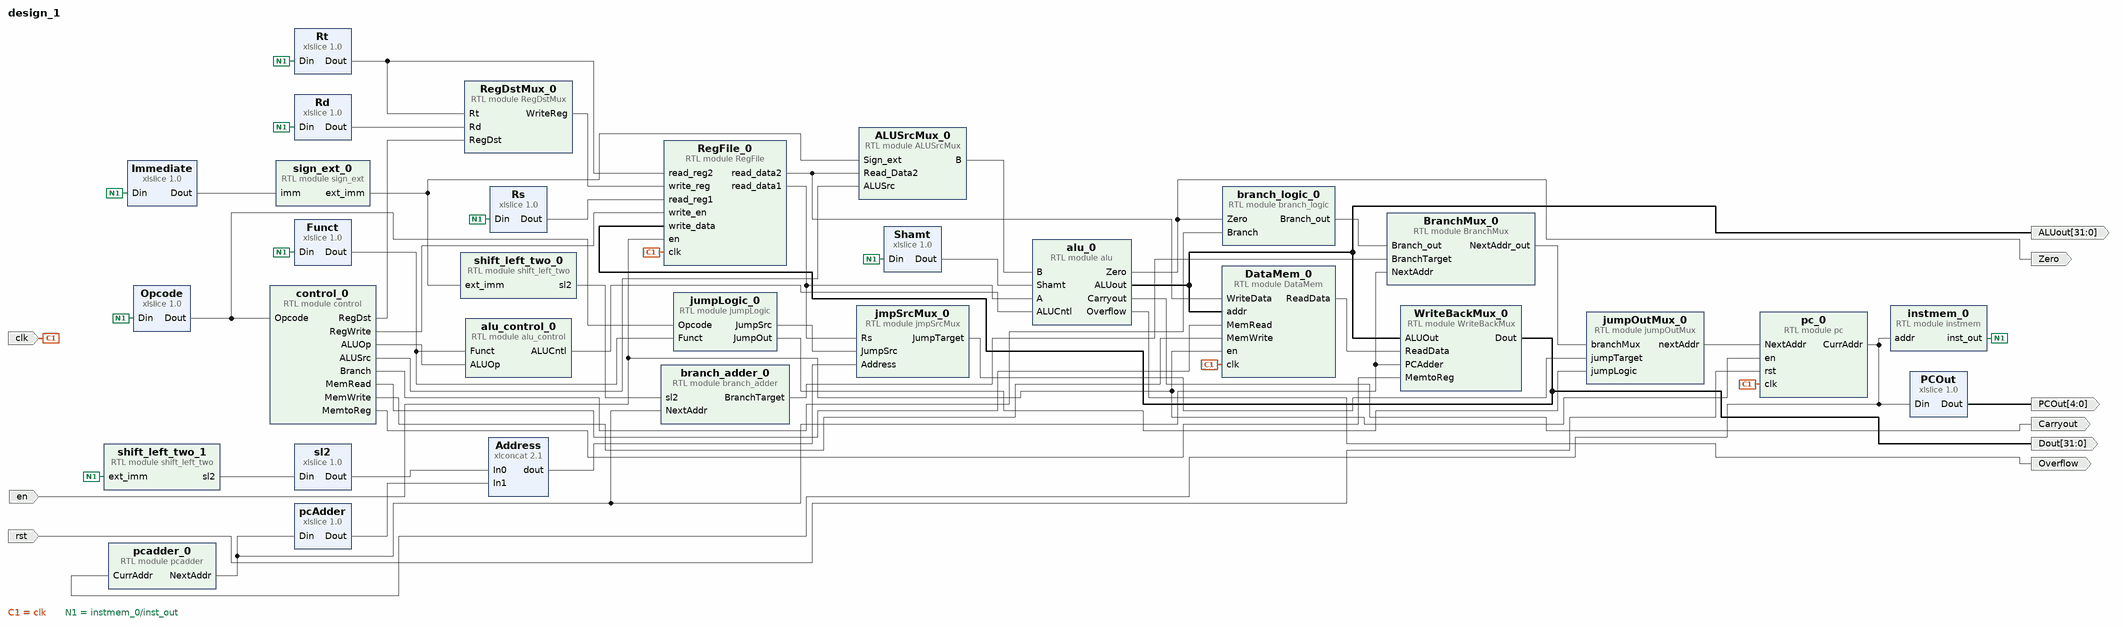
[diagram p0: block diagram of the top level]
# Vivado block design design_1, xc7a35tcpg236-1, Vivado 2023.2
create_bd_design design_1

create_bd_port -dir I -type clk clk
set_property -dict {CONFIG.FREQ_HZ 100000000} [get_bd_ports clk]
create_bd_port -dir I -type rst rst
create_bd_port -dir I -type ce en
create_bd_port -dir O -from 31 -to 0 ALUout
create_bd_port -dir O Carryout
create_bd_port -dir O Overflow
create_bd_port -dir O Zero
create_bd_port -dir O -from 4 -to 0 -type data PCOut
create_bd_port -dir O -from 31 -to 0 -type data Dout

create_bd_cell -type module -reference pc pc_0
create_bd_cell -type module -reference pcadder pcadder_0
create_bd_cell -type module -reference instmem instmem_0
create_bd_cell -type ip -vlnv xilinx.com:ip:xlslice:1.0 Opcode
set_property -dict {CONFIG.DIN_FROM 31 CONFIG.DIN_TO 26} [get_bd_cells Opcode]
create_bd_cell -type ip -vlnv xilinx.com:ip:xlslice:1.0 Rs
set_property -dict {CONFIG.DIN_FROM 25 CONFIG.DIN_TO 21} [get_bd_cells Rs]
create_bd_cell -type ip -vlnv xilinx.com:ip:xlslice:1.0 Rt
set_property -dict {CONFIG.DIN_FROM 20 CONFIG.DIN_TO 16} [get_bd_cells Rt]
create_bd_cell -type ip -vlnv xilinx.com:ip:xlslice:1.0 Rd
set_property -dict {CONFIG.DIN_FROM 15 CONFIG.DIN_TO 11} [get_bd_cells Rd]
create_bd_cell -type ip -vlnv xilinx.com:ip:xlslice:1.0 Shamt
set_property -dict {CONFIG.DIN_FROM 10 CONFIG.DIN_TO 6} [get_bd_cells Shamt]
create_bd_cell -type ip -vlnv xilinx.com:ip:xlslice:1.0 Immediate
set_property -dict {CONFIG.DIN_FROM 15} [get_bd_cells Immediate]
create_bd_cell -type ip -vlnv xilinx.com:ip:xlslice:1.0 Funct
set_property -dict {CONFIG.DIN_FROM 5} [get_bd_cells Funct]
create_bd_cell -type module -reference sign_ext sign_ext_0
create_bd_cell -type module -reference RegDstMux RegDstMux_0
create_bd_cell -type module -reference RegFile RegFile_0
create_bd_cell -type module -reference control control_0
create_bd_cell -type module -reference ALUSrcMux ALUSrcMux_0
create_bd_cell -type module -reference alu_control alu_control_0
create_bd_cell -type module -reference alu alu_0
create_bd_cell -type ip -vlnv xilinx.com:ip:xlslice:1.0 PCOut
set_property -dict {CONFIG.DIN_FROM 6 CONFIG.DIN_TO 2} [get_bd_cells PCOut]
create_bd_cell -type module -reference DataMem DataMem_0
create_bd_cell -type module -reference WriteBackMux WriteBackMux_0
create_bd_cell -type module -reference branch_logic branch_logic_0
create_bd_cell -type module -reference shift_left_two shift_left_two_0
create_bd_cell -type module -reference branch_adder branch_adder_0
create_bd_cell -type module -reference BranchMux BranchMux_0
create_bd_cell -type module -reference shift_left_two shift_left_two_1
create_bd_cell -type ip -vlnv xilinx.com:ip:xlslice:1.0 sl2
set_property -dict {CONFIG.DIN_FROM 27} [get_bd_cells sl2]
create_bd_cell -type ip -vlnv xilinx.com:ip:xlslice:1.0 pcAdder
set_property -dict {CONFIG.DIN_FROM 31 CONFIG.DIN_TO 28} [get_bd_cells pcAdder]
create_bd_cell -type module -reference jumpLogic jumpLogic_0
create_bd_cell -type ip -vlnv xilinx.com:ip:xlconcat:2.1 Address
set_property -dict {CONFIG.IN0_WIDTH 28 CONFIG.IN1_WIDTH 4} [get_bd_cells Address]
create_bd_cell -type module -reference jumpOutMux jumpOutMux_0
create_bd_cell -type module -reference jmpSrcMux jmpSrcMux_0

# ---- connections ----

connect_bd_net [get_bd_pins ALUSrcMux_0/B] [get_bd_pins alu_0/B]
connect_bd_net [get_bd_pins Address/dout] [get_bd_pins jmpSrcMux_0/Address]
connect_bd_net [get_bd_pins BranchMux_0/NextAddr_out] [get_bd_pins jumpOutMux_0/branchMux]
connect_bd_net [get_bd_pins DataMem_0/ReadData] [get_bd_pins WriteBackMux_0/ReadData]
connect_bd_net [get_bd_pins Funct/Dout] [get_bd_pins alu_control_0/Funct] [get_bd_pins jumpLogic_0/Funct]
connect_bd_net [get_bd_pins Immediate/Dout] [get_bd_pins sign_ext_0/imm]
connect_bd_net [get_bd_pins Opcode/Dout] [get_bd_pins jumpLogic_0/Opcode] [get_bd_pins control_0/Opcode]
connect_bd_net [get_bd_pins PCOut/Dout] [get_bd_ports PCOut]
connect_bd_net [get_bd_pins Rd/Dout] [get_bd_pins RegDstMux_0/Rd]
connect_bd_net [get_bd_pins RegDstMux_0/WriteReg] [get_bd_pins RegFile_0/write_reg]
connect_bd_net [get_bd_pins RegFile_0/read_data1] [get_bd_pins alu_0/A] [get_bd_pins jmpSrcMux_0/Rs]
connect_bd_net [get_bd_pins RegFile_0/read_data2] [get_bd_pins ALUSrcMux_0/Read_Data2] [get_bd_pins DataMem_0/WriteData]
connect_bd_net [get_bd_pins Rs/Dout] [get_bd_pins RegFile_0/read_reg1]
connect_bd_net [get_bd_pins Rt/Dout] [get_bd_pins RegFile_0/read_reg2] [get_bd_pins RegDstMux_0/Rt]
connect_bd_net [get_bd_pins Shamt/Dout] [get_bd_pins alu_0/Shamt]
connect_bd_net [get_bd_pins WriteBackMux_0/Dout] [get_bd_ports Dout] [get_bd_pins RegFile_0/write_data]
connect_bd_net [get_bd_pins alu_0/ALUout] [get_bd_ports ALUout] [get_bd_pins WriteBackMux_0/ALUOut] [get_bd_pins DataMem_0/addr]
connect_bd_net [get_bd_pins alu_0/Carryout] [get_bd_ports Carryout]
connect_bd_net [get_bd_pins alu_0/Overflow] [get_bd_ports Overflow]
connect_bd_net [get_bd_pins alu_0/Zero] [get_bd_ports Zero] [get_bd_pins branch_logic_0/Zero]
connect_bd_net [get_bd_pins alu_control_0/ALUCntl] [get_bd_pins alu_0/ALUCntl]
connect_bd_net [get_bd_pins branch_adder_0/BranchTarget] [get_bd_pins BranchMux_0/BranchTarget]
connect_bd_net [get_bd_pins branch_logic_0/Branch_out] [get_bd_pins BranchMux_0/Branch_out]
connect_bd_net [get_bd_ports clk] [get_bd_pins pc_0/clk] [get_bd_pins RegFile_0/clk] [get_bd_pins DataMem_0/clk]
connect_bd_net [get_bd_pins control_0/ALUOp] [get_bd_pins alu_control_0/ALUOp]
connect_bd_net [get_bd_pins control_0/ALUSrc] [get_bd_pins ALUSrcMux_0/ALUSrc]
connect_bd_net [get_bd_pins control_0/Branch] [get_bd_pins branch_logic_0/Branch]
connect_bd_net [get_bd_pins control_0/MemRead] [get_bd_pins DataMem_0/MemRead]
connect_bd_net [get_bd_pins control_0/MemWrite] [get_bd_pins DataMem_0/MemWrite]
connect_bd_net [get_bd_pins control_0/MemtoReg] [get_bd_pins WriteBackMux_0/MemtoReg]
connect_bd_net [get_bd_pins control_0/RegDst] [get_bd_pins RegDstMux_0/RegDst]
connect_bd_net [get_bd_pins control_0/RegWrite] [get_bd_pins RegFile_0/write_en]
connect_bd_net [get_bd_ports en] [get_bd_pins pc_0/en] [get_bd_pins RegFile_0/en] [get_bd_pins DataMem_0/en]
connect_bd_net [get_bd_pins instmem_0/inst_out] \
  [get_bd_pins Rt/Din] [get_bd_pins Rs/Din] [get_bd_pins Opcode/Din] [get_bd_pins Rd/Din] [get_bd_pins Shamt/Din] \
  [get_bd_pins Immediate/Din] [get_bd_pins Funct/Din] [get_bd_pins shift_left_two_1/ext_imm]
connect_bd_net [get_bd_pins jmpSrcMux_0/JumpTarget] [get_bd_pins jumpOutMux_0/jumpTarget]
connect_bd_net [get_bd_pins jumpLogic_0/JumpOut] [get_bd_pins jumpOutMux_0/jumpLogic]
connect_bd_net [get_bd_pins jumpLogic_0/JumpSrc] [get_bd_pins jmpSrcMux_0/JumpSrc]
connect_bd_net [get_bd_pins jumpOutMux_0/nextAddr] [get_bd_pins pc_0/NextAddr]
connect_bd_net [get_bd_pins pcAdder/Dout] [get_bd_pins Address/In1]
connect_bd_net [get_bd_pins pc_0/CurrAddr] [get_bd_pins PCOut/Din] [get_bd_pins pcadder_0/CurrAddr] [get_bd_pins instmem_0/addr]
connect_bd_net [get_bd_pins pcadder_0/NextAddr] \
  [get_bd_pins branch_adder_0/NextAddr] [get_bd_pins BranchMux_0/NextAddr] [get_bd_pins pcAdder/Din] \
  [get_bd_pins WriteBackMux_0/PCAdder]
connect_bd_net [get_bd_ports rst] [get_bd_pins pc_0/rst]
connect_bd_net [get_bd_pins shift_left_two_0/sl2] [get_bd_pins branch_adder_0/sl2]
connect_bd_net [get_bd_pins shift_left_two_1/sl2] [get_bd_pins sl2/Din]
connect_bd_net [get_bd_pins sign_ext_0/ext_imm] [get_bd_pins ALUSrcMux_0/Sign_ext] [get_bd_pins shift_left_two_0/ext_imm]
connect_bd_net [get_bd_pins sl2/Dout] [get_bd_pins Address/In0]

validate_bd_design
save_bd_design
